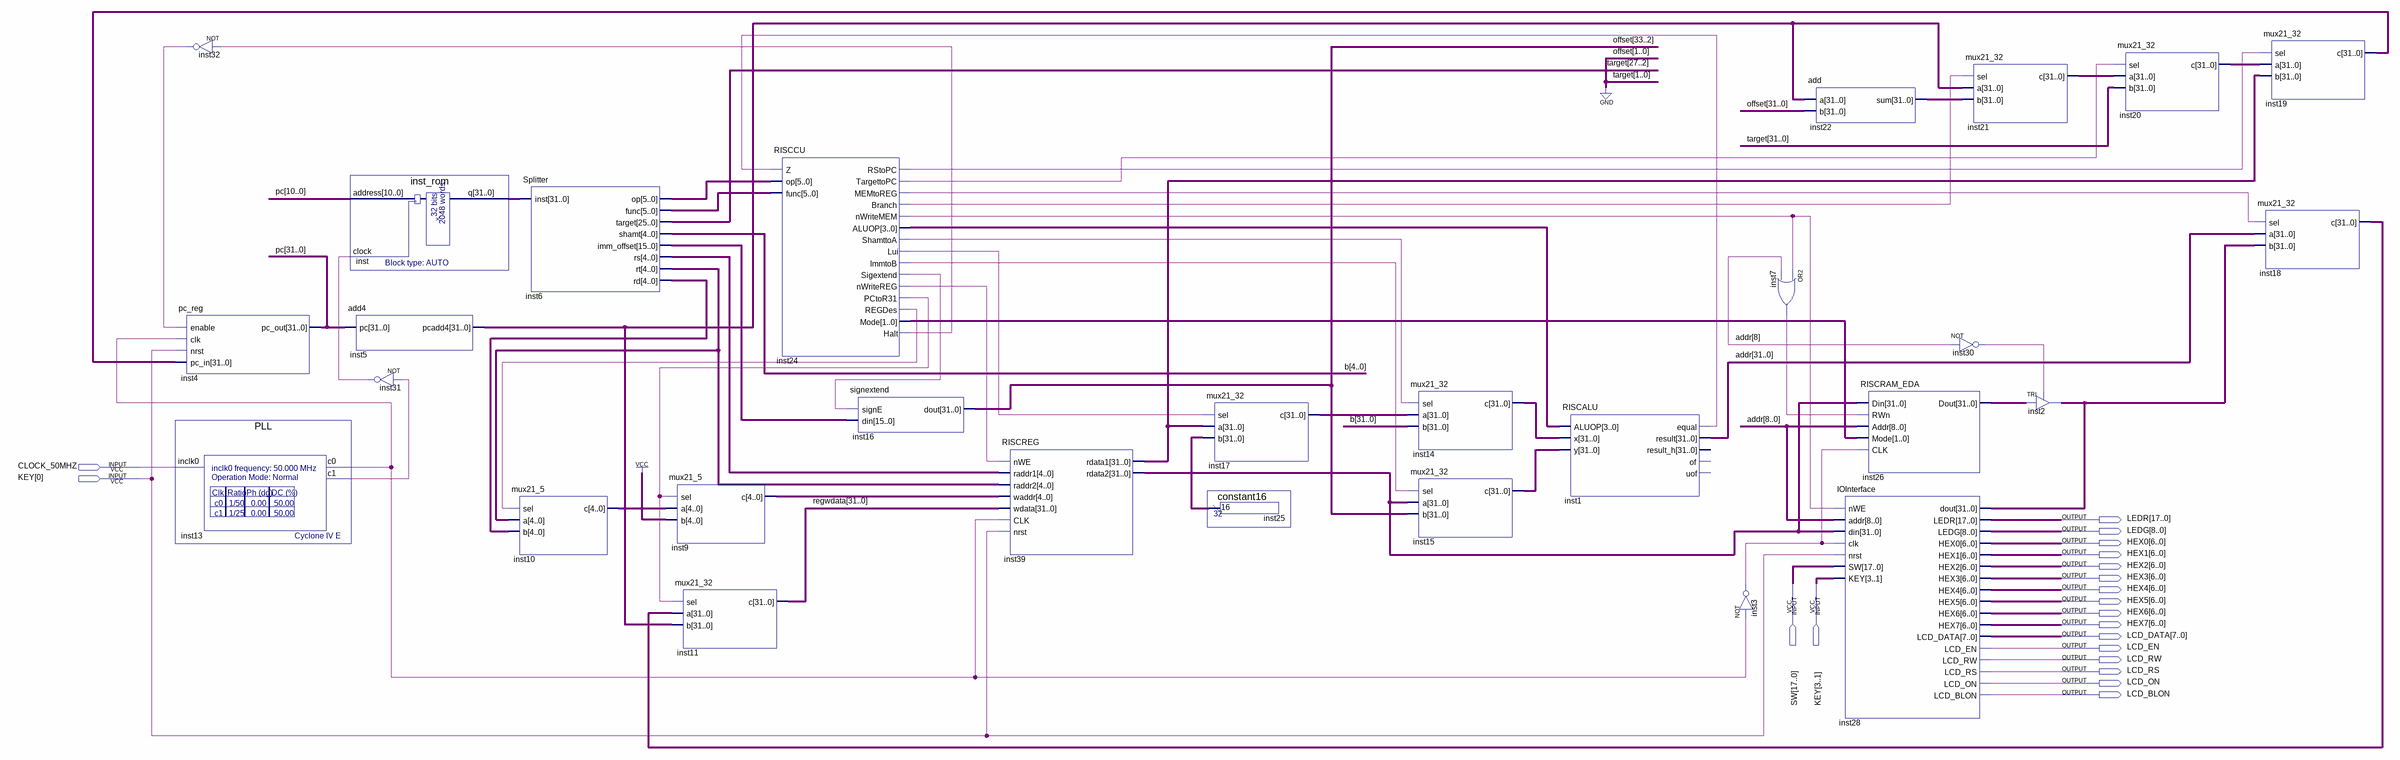
[diagram p0: schematic sheet]
// Quartus schematic MIPS_Single_Cycle_IO.bdf as structural Verilog: 29 symbols, 20 pins
module MIPS_Single_Cycle_IO (
  input  CLOCK_50MHZ,
  input  [3:0] KEY,
  input  [17:0] SW,
  output [17:0] LEDR,
  output [8:0] LEDG,
  output [6:0] HEX0,
  output [6:0] HEX1,
  output [6:0] HEX2,
  output [6:0] HEX3,
  output [6:0] HEX4,
  output [6:0] HEX5,
  output [6:0] HEX6,
  output [6:0] HEX7,
  output [7:0] LCD_DATA,
  output LCD_EN,
  output LCD_RW,
  output LCD_RS,
  output LCD_ON,
  output LCD_BLON
);

  wire inst1_equal, inst3_out, inst7_out, inst13_c0, inst13_c1, inst24_branch, inst24_halt, inst24_immtob,
       inst24_lui, inst24_memtoreg, inst24_nwritemem, inst24_nwritereg, inst24_pctor31, inst24_regdes,
       inst24_rstopc, inst24_shamttoa, inst24_sigextend, inst24_targettopc, inst30_out, inst31_out,
       inst32_out;
  wire [1:0] inst24_mode;
  wire [3:0] inst24_aluop;
  wire [4:0] inst6_rd, inst6_rs, inst6_rt, inst9_c, inst10_c;
  wire [5:0] inst6_func, inst6_op;
  wire [15:0] inst6_imm_offset;
  wire [31:0] addr, b, inst5_pcadd4, inst14_c, inst15_c, inst17_c, inst18_c, inst19_c, inst20_c, inst21_c,
       inst22_sum, inst25_result, inst26_dout, inst28_dout, inst39_rdata1, inst39_rdata2, inst_q, pc,
       regwdata;
  wire [31:2] target;
  wire [33:0] offset;

  not inst32 (inst32_out, inst24_halt);
  pc_reg inst4 (.enable(inst32_out), .clk(inst13_c0), .nrst(KEY[0]), .pc_in(inst19_c), .pc_out(pc));
  PLL inst13 (.inclk0(CLOCK_50MHZ), .c0(inst13_c0), .c1(inst13_c1));
  inst_rom inst (.address(pc[10:0]), .clock(inst31_out), .q(inst_q));
  add4 inst5 (.pc(pc), .pcadd4(inst5_pcadd4));
  not inst31 (inst31_out, inst13_c1);
  Splitter inst6 (
    .inst(inst_q), .op(inst6_op), .func(inst6_func), .target(target[27:2]), .shamt(b[4:0]),
    .imm_offset(inst6_imm_offset), .rs(inst6_rs), .rt(inst6_rt), .rd(inst6_rd));
  mux21_5 inst10 (.sel(inst24_regdes), .a(inst6_rt), .b(inst6_rd), .c(inst10_c));
  mux21_5 inst9 (.sel(inst24_pctor31), .a(inst10_c), .b({5{1'b1}}), .c(inst9_c));
  mux21_32 inst11 (.sel(inst24_pctor31), .a(inst18_c), .b(inst5_pcadd4), .c(regwdata));
  RISCCU inst24 (
    .Z(inst1_equal), .op(inst6_op), .func(inst6_func), .RStoPC(inst24_rstopc),
    .TargettoPC(inst24_targettopc), .MEMtoREG(inst24_memtoreg), .Branch(inst24_branch),
    .nWriteMEM(inst24_nwritemem), .ALUOP(inst24_aluop), .ShamttoA(inst24_shamttoa), .Lui(inst24_lui),
    .ImmtoB(inst24_immtob), .Sigextend(inst24_sigextend), .nWriteREG(inst24_nwritereg),
    .PCtoR31(inst24_pctor31), .REGDes(inst24_regdes), .Mode(inst24_mode), .Halt(inst24_halt));
  signextend inst16 (.signE(inst24_sigextend), .din(inst6_imm_offset), .dout(offset[33:2]));
  RISCREG inst39 (
    .nWE(inst24_nwritereg), .raddr1(inst6_rs), .raddr2(inst6_rt), .waddr(inst9_c), .wdata(regwdata),
    .CLK(inst13_c0), .nrst(KEY[0]), .rdata1(inst39_rdata1), .rdata2(inst39_rdata2));
  mux21_32 inst17 (.sel(inst24_lui), .a(inst39_rdata1), .b(inst25_result), .c(inst17_c));
  constant16 inst25 (.result(inst25_result));
  mux21_32 inst14 (.sel(inst24_shamttoa), .a(inst17_c), .b(b), .c(inst14_c));
  mux21_32 inst15 (.sel(inst24_immtob), .a(inst39_rdata2), .b(offset[33:2]), .c(inst15_c));
  RISCALU inst1 (
    .ALUOP(inst24_aluop), .x(inst14_c), .y(inst15_c), .equal(inst1_equal), .result(addr));  // open: result_h, of, uof
  not inst3 (inst3_out, inst13_c0);
  add inst22 (.a(inst5_pcadd4), .b(offset[31:0]), .sum(inst22_sum));
  or inst7 (inst7_out, inst24_nwritemem, addr[8]);
  IOInterface inst28 (
    .nWE(inst24_nwritemem), .addr(addr[8:0]), .din(inst39_rdata2), .clk(inst3_out), .nrst(KEY[0]), .SW(SW),
    .KEY(KEY[3:1]), .dout(inst28_dout), .LEDR(LEDR), .LEDG(LEDG), .HEX0(HEX0), .HEX1(HEX1), .HEX2(HEX2),
    .HEX3(HEX3), .HEX4(HEX4), .HEX5(HEX5), .HEX6(HEX6), .HEX7(HEX7), .LCD_DATA(LCD_DATA), .LCD_EN(LCD_EN),
    .LCD_RW(LCD_RW), .LCD_RS(LCD_RS), .LCD_ON(LCD_ON), .LCD_BLON(LCD_BLON));
  RISCRAM_EDA inst26 (
    .Din(inst39_rdata2), .RWn(inst7_out), .Addr(addr[8:0]), .Mode(inst24_mode), .CLK(inst3_out),
    .Dout(inst26_dout));
  mux21_32 inst21 (.sel(inst24_branch), .a(inst5_pcadd4), .b(inst22_sum), .c(inst21_c));
  not inst30 (inst30_out, addr[8]);
  TRI inst2[31:0] (.IN(inst26_dout), .OE(inst30_out), .OUT(inst28_dout));
  mux21_32 inst20 (.sel(inst24_targettopc), .a(inst21_c), .b({target, 2'b00}), .c(inst20_c));
  mux21_32 inst19 (.sel(inst24_rstopc), .a(inst20_c), .b(inst39_rdata1), .c(inst19_c));
  mux21_32 inst18 (.sel(inst24_memtoreg), .a(addr), .b(inst28_dout), .c(inst18_c));
endmodule
